# EAGLE design SchoolBoard (EAGLE 9.4.2)

## Sheet 1 of 2
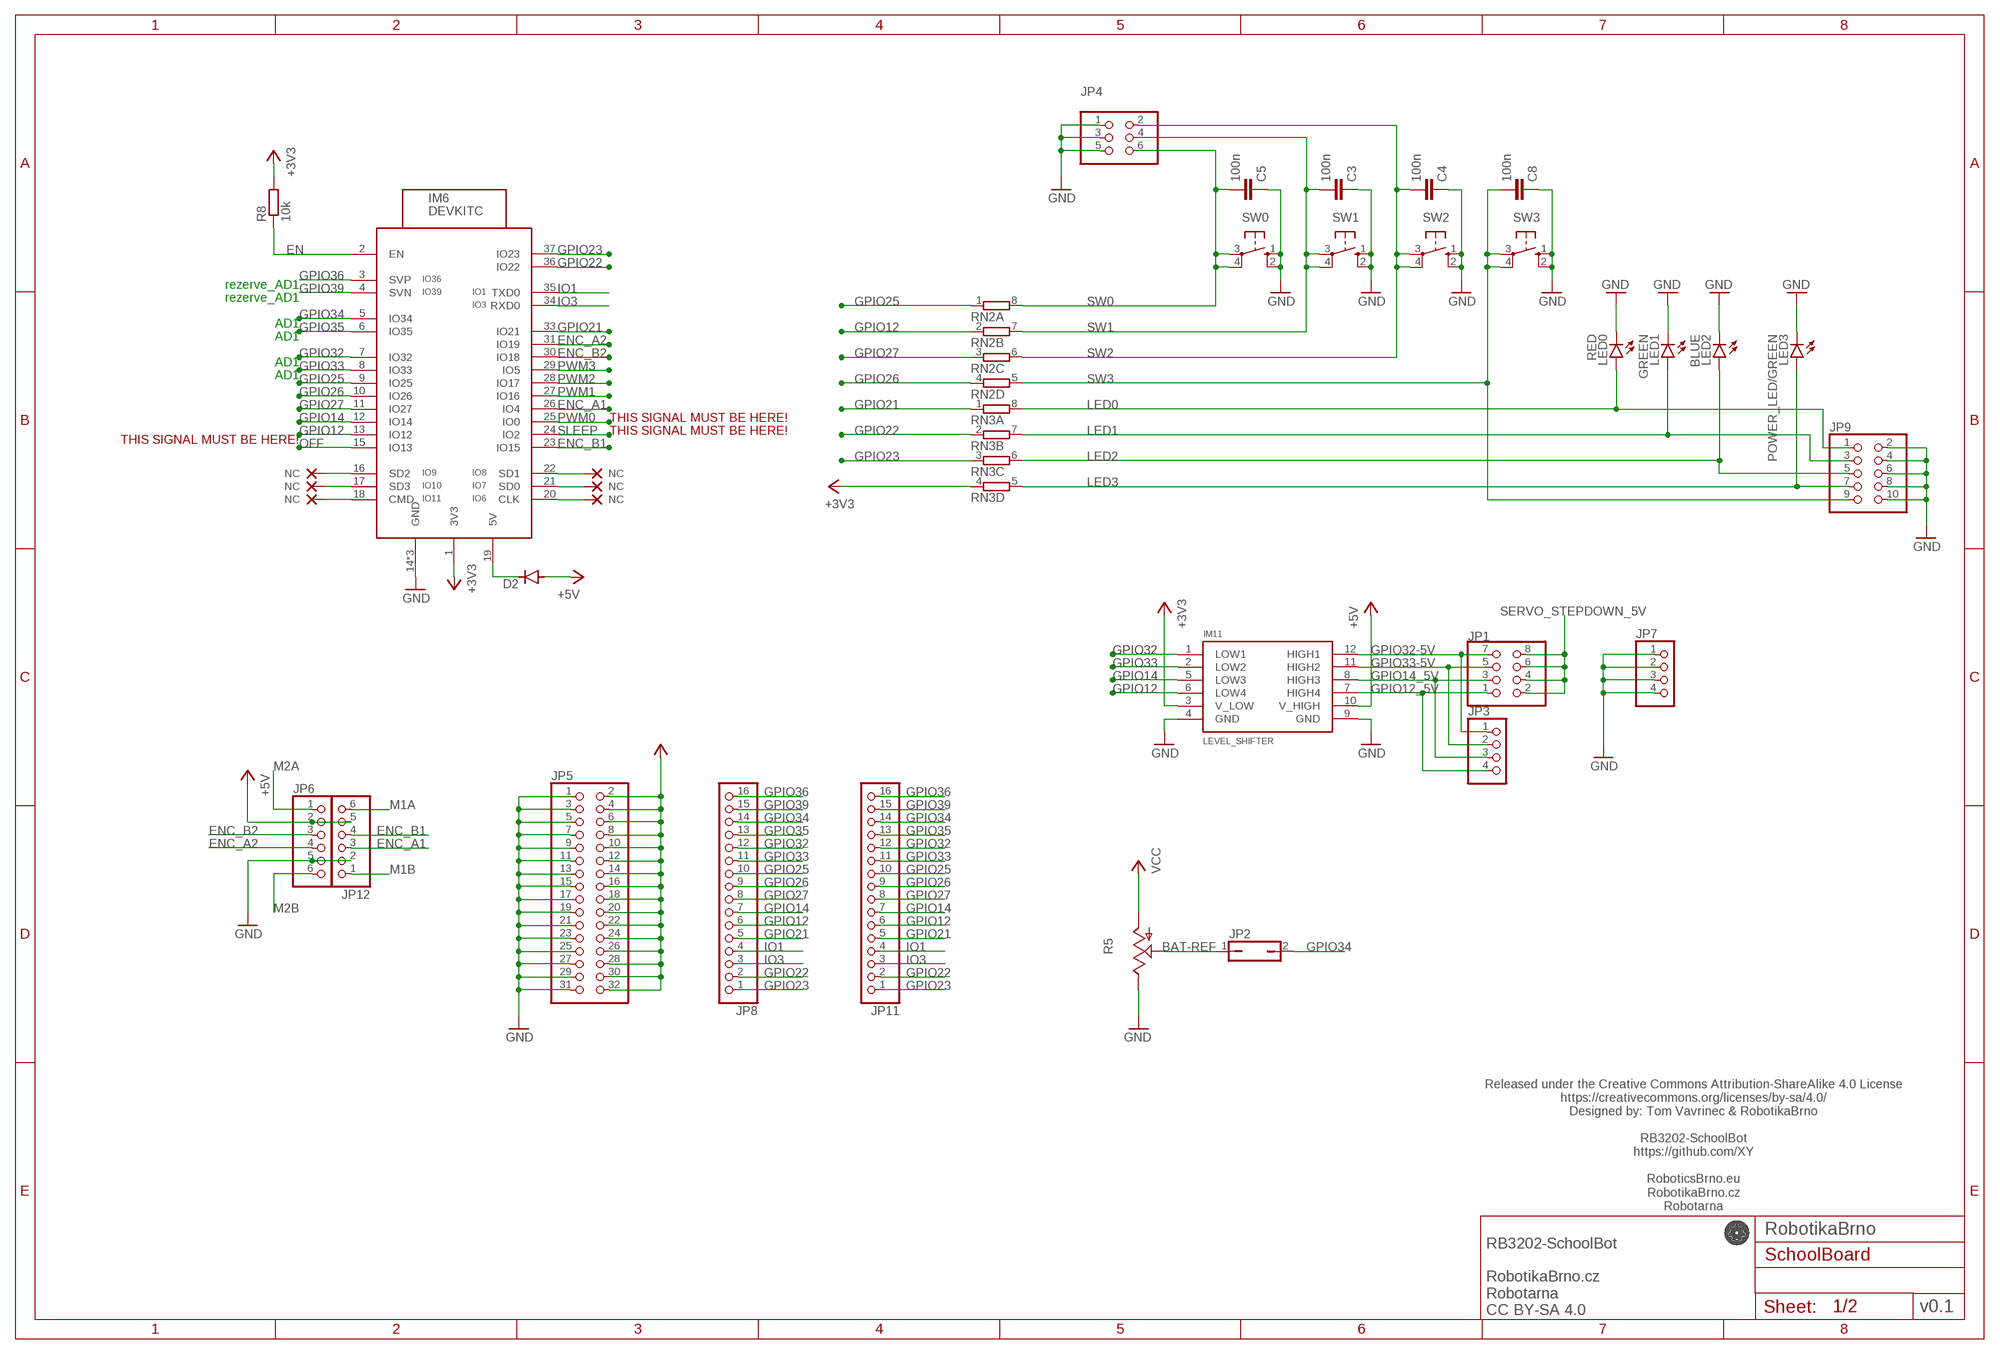
[diagram p0: schematic, sheet 1]

### Parts
C3  100n  C-EUC1206  [C1206]
C4  100n  C-EUC1206  [C1206]
C5  100n  C-EUC1206  [C1206]
C8  100n  C-EUC1206  [C1206]
D2  DIODE-D-7.5  [D-7.5]
IM6  DEVKITC  [DEVKITC]
IM11  LEVEL_SHIFTER  [LEVEL_SHIFTER]
JP1  PINHD-2X4  [2X04]
JP2  JP1Q  [JP1]
JP3  PINHD-1X4  [1X04]
JP4  PINHD-2X3  [2X03]
JP5  PINHD-2X16  [2X16]
JP6  PINHD-1X6  [1X06]
JP7  PINHD-1X4  [1X04]
JP8  PINHD-1X16  [1X16]
JP9  PINHD-2X5  [2X05]
JP11  PINHD-1X16  [1X16]
JP12  PINHD-1X6  [1X06]
LED0  RED  LED3MM  [LED3MM]
LED1  GREEN  LED3MM  [LED3MM]
LED2  BLUE  LED3MM  [LED3MM]
LED3  POWER_LED/GREEN  LED3MM  [LED3MM]
NC1  NC  (no package)
NC2  NC  (no package)
NC3  NC  (no package)
NC4  NC  (no package)
NC5  NC  (no package)
NC6  NC  (no package)
R5  TRIM_US-SM-42/43X  [SM-42/43X]
R8  10k  R-EU_R0805  [R0805]
RN2  4R-NEXBS8V  [EXBS8V]
RN3  4R-NEXBS8V  [EXBS8V]
SW0  10-XX  [B3F-10XX]
SW1  10-XX  [B3F-10XX]
SW2  10-XX  [B3F-10XX]
SW3  10-XX  [B3F-10XX]

### Nets
+3V3: IM6.1(3V3) IM11.3(V_LOW) JP5.2 JP5.4 JP5.6 JP5.8 JP5.10 JP5.12 JP5.14 JP5.16 JP5.18 JP5.20 JP5.22 JP5.24 JP5.26 JP5.28 JP5.30 JP5.32 R8.2 RN3.4 ; also sheet 2
+5V: D2.A IM11.10(V_HIGH) JP6.2 JP12.5 ; also sheet 2
+5V_ESP: D2.C IM6.19(5V)
BAT-REF: JP2.1 R5.2(S)
EN: IM6.2(EN) R8.1 ; also sheet 2
ENC_A1: IM6.26(IO4) JP12.3
ENC_A2: IM6.31(IO19) JP6.4
ENC_B1: IM6.23(IO15) JP12.4
ENC_B2: IM6.30(IO18) JP6.3
GND: C3.1 C4.1 C5.1 C8.1 IM6.14(GND) IM6.32(GND) IM6.38(GND) IM11.4(GND) IM11.9(GND) JP4.1 JP4.3 JP4.5 JP5.1 JP5.3 JP5.5 JP5.7 JP5.9 JP5.11 JP5.13 JP5.15 JP5.17 JP5.19 JP5.21 JP5.23 JP5.25 JP5.27 JP5.29 JP5.31 JP6.5 JP7.1 JP7.2 JP7.3 JP7.4 JP9.2 JP9.4 JP9.6 JP9.8 JP9.10 JP12.2 LED0.K(C) LED1.K(C) LED2.K(C) LED3.K(C) R5.3(E) SW0.1(S) SW0.2(S1) SW1.1(S) SW1.2(S1) SW2.1(S) SW2.2(S1) SW3.1(S) SW3.2(S1) ; also sheet 2
GPIO12: IM6.13(IO12) IM11.6(LOW4) JP8.6 JP11.6 RN2.2
GPIO12_5V: IM11.7(HIGH4) JP1.1 JP3.4
GPIO14: IM6.12(IO14) IM11.5(LOW3) JP8.7 JP11.7
GPIO14_5V: IM11.8(HIGH3) JP1.3 JP3.3
GPIO21: IM6.33(IO21) JP8.5 JP11.5 RN3.1
GPIO22: IM6.36(IO22) JP8.2 JP11.2 RN3.2
GPIO23: IM6.37(IO23) JP8.1 JP11.1 RN3.3
GPIO25: IM6.9(IO25) JP8.10 JP11.10 RN2.1
GPIO26: IM6.10(IO26) JP8.9 JP11.9 RN2.4
GPIO27: IM6.11(IO27) JP8.8 JP11.8 RN2.3
GPIO32: IM6.7(IO32) IM11.1(LOW1) JP8.12 JP11.12
GPIO32-5V: IM11.12(HIGH1) JP1.7 JP3.1
GPIO33: IM6.8(IO33) IM11.2(LOW2) JP8.11 JP11.11
GPIO33-5V: IM11.11(HIGH2) JP1.5 JP3.2
GPIO34: IM6.5(IO34) JP2.2 JP8.14 JP11.14
GPIO35: IM6.6(IO35) JP8.13 JP11.13 ; also sheet 2
GPIO36: IM6.3(SVP) JP8.16 JP11.16
GPIO39: IM6.4(SVN) JP8.15 JP11.15
IO1: IM6.35(TXD0) JP8.4 JP11.4
IO3: IM6.34(RXD0) JP8.3 JP11.3
IO9_NC: IM6.16(SD2) NC1.NC
IO9_NC1: IM6.20(CLK) NC4.NC
IO10_NC: IM6.17(SD3) NC2.NC
IO10_NC1: IM6.21(SD0) NC5.NC
IO11_NC: IM6.18(CMD) NC3.NC
IO11_NC1: IM6.22(SD1) NC6.NC
LED0: JP9.1 LED0.A RN3.8
LED1: JP9.3 LED1.A RN3.7
LED2: JP9.5 LED2.A RN3.6
LED3: JP9.7 LED3.A RN3.5
M1A: JP12.6 ; also sheet 2
M1B: JP12.1 ; also sheet 2
M2A: JP6.1 ; also sheet 2
M2B: JP6.6 ; also sheet 2
OFF: IM6.15(IO13) ; also sheet 2
PWM0: IM6.25(IO0) ; also sheet 2
PWM1: IM6.27(IO16) ; also sheet 2
PWM2: IM6.28(IO17) ; also sheet 2
PWM3: IM6.29(IO5) ; also sheet 2
SERVO_STEPDOWN_5V: JP1.2 JP1.4 JP1.6 JP1.8 ; also sheet 2
SLEEP: IM6.24(IO2) ; also sheet 2
SW0: C5.2 JP4.6 RN2.8 SW0.3(P) SW0.4(P1)
SW1: C3.2 JP4.4 RN2.7 SW1.3(P) SW1.4(P1)
SW2: C4.2 JP4.2 RN2.6 SW2.3(P) SW2.4(P1)
SW3: C8.2 JP9.9 RN2.5 SW3.3(P) SW3.4(P1)
VCC: R5.1(A) ; also sheet 2

### Notes on the sheet
- rezerve_AD1
- rezerve_AD1
- AD1
- AD1
- AD1
- AD1
- THIS SIGNAL MUST BE HERE!
- THIS SIGNAL MUST BE HERE! | THIS SIGNAL MUST BE HERE!
- Released under the Creative Commons Attribution-ShareAlike 4.0 License
  https://creativecommons.org/licenses/by-sa/4.0/
  Designed by: Tom Vavrinec & RobotikaBrno
  
  RB3202-SchoolBot
  https://github.com/XY
  
  RoboticsBrno.eu
  RobotikaBrno.cz
  Robotarna
- RobotikaBrno
- v0.1
- RB3202-SchoolBot
  
  RobotikaBrno.cz
  Robotarna
  CC BY-SA 4.0

## Sheet 2 of 2
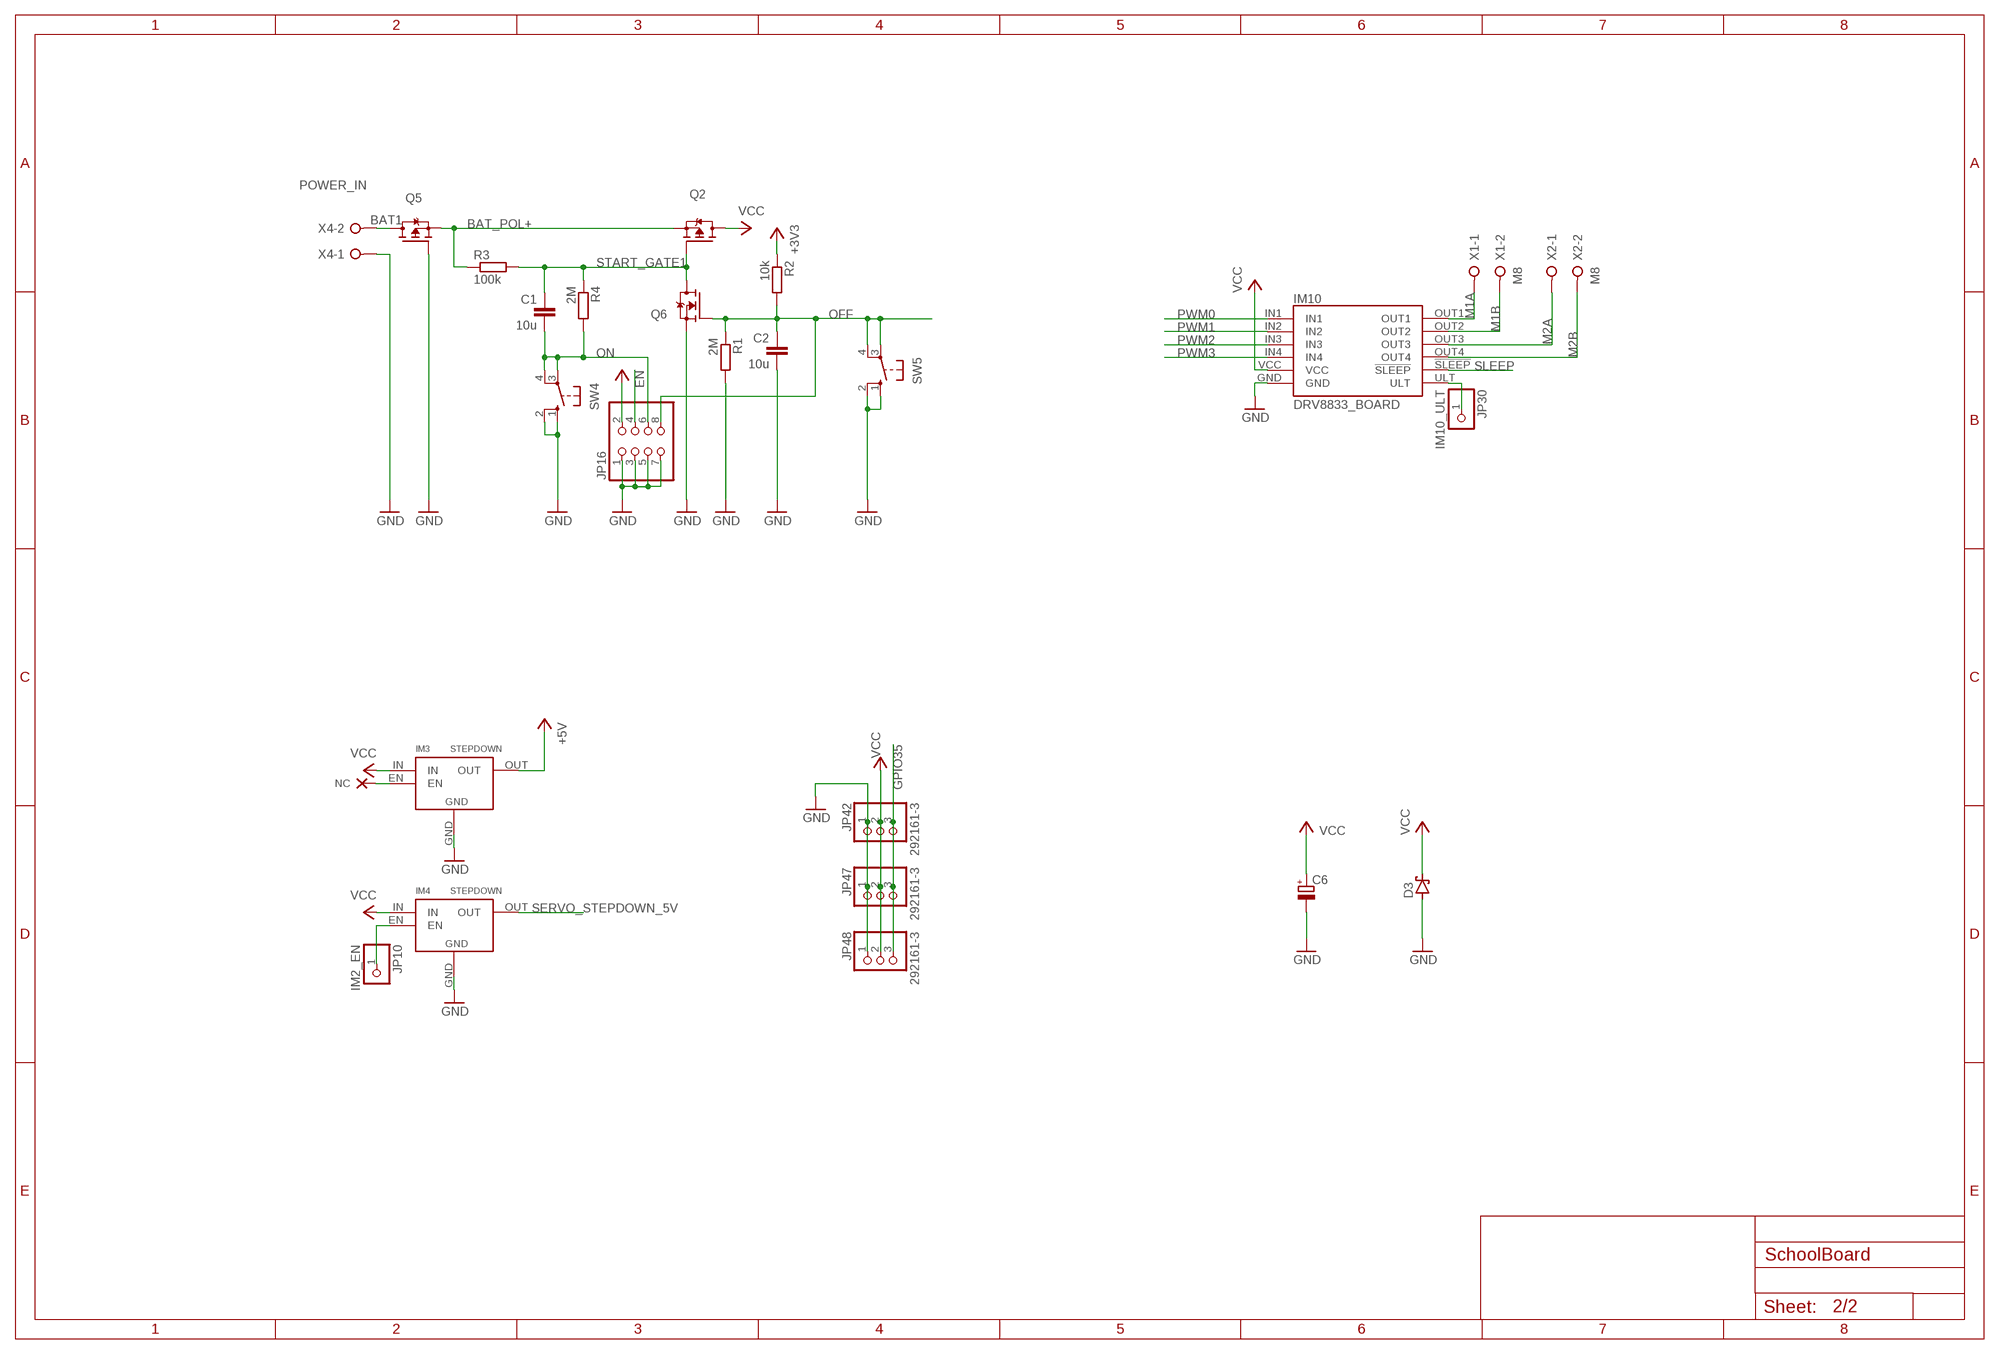
[diagram p1: schematic, sheet 2]

### Parts
C1  10u  C-EUC1206  [C1206]
C2  10u  C-EUC1206  [C1206]
C6  CPOL-EUE5-10.5  [E5-10,5]
D3  SCHOTTKY-DIODEF126Z12  [F126Z12]
IM3  STEPDOWN  [STEPDOWN]
IM4  STEPDOWN  [STEPDOWN]
IM10  DRV8833_BOARD  [PINHEAD]
JP10  IM2_EN  PINHD-1X1  [1X01]
JP16  PINHD-2X4  [2X04]
JP30  IM10_ULT  PINHD-1X1  [1X01]
JP42  292161-3  [292161-3]
JP47  292161-3  [292161-3]
JP48  292161-3  [292161-3]
NC7  NC  (no package)
Q2  P-MOSFET-TO220V  [TO220V]
Q5  P-MOSFET-TO220V  [TO220V]
Q6  N-MOSFET-SOT23-GSD  [SOT23]
R1  2M  R-EU_R0805  [R0805]
R2  10k  R-EU_R0805  [R0805]
R3  100k  R-EU_R0805  [R0805]
R4  2M  R-EU_M0805  [M0805]
SW4  10-XX  [B3F-10XX]
SW5  10-XX  [B3F-10XX]
X1  M8  W237-02P  [W237-132]
X2  M8  W237-02P  [W237-132]
X4  POWER_IN  W237-02P  [W237-132]

### Nets
+3V3: R2.1 ; also sheet 1
+5V: IM3.OUT JP16.2 ; also sheet 1
BAT1: Q5.2(D) X4.2
BAT_POL+: Q2.3(S) Q5.3(S) R3.1
EN: JP16.4 ; also sheet 1
GND: C2.2 C6.- D3.A IM3.GND IM4.GND IM10.GND JP16.1 JP16.3 JP16.5 JP16.7 JP42.1 JP47.1 JP48.1 Q5.1(G) Q6.2(S) R1.2 SW4.1(S) SW4.2(S1) SW5.1(S) SW5.2(S1) X4.1 ; also sheet 1
GPIO35: JP42.3 JP47.3 JP48.3 ; also sheet 1
IO9_NC2: IM3.EN NC7.NC
M1A: IM10.OUT1 X1.1 ; also sheet 1
M1B: IM10.OUT2 X1.2 ; also sheet 1
M2A: IM10.OUT3 X2.1 ; also sheet 1
M2B: IM10.OUT4 X2.2 ; also sheet 1
N$1: IM10.ULT JP30.1
OFF: C2.1 JP16.8 Q6.1(G) R1.1 R2.2 SW5.3(P) SW5.4(P1) ; also sheet 1
ON: C1.2 JP16.6 R4.2 SW4.3(P) SW4.4(P1)
PWM0: IM10.IN1 ; also sheet 1
PWM1: IM10.IN2 ; also sheet 1
PWM2: IM10.IN3 ; also sheet 1
PWM3: IM10.IN4 ; also sheet 1
SERVO_STEPDOWN_5V: IM4.OUT ; also sheet 1
SLEEP: IM10.!SLEEP ; also sheet 1
START_GATE1: C1.1 Q2.1(G) Q6.3(D) R3.2 R4.1
STEP2_EN1: IM4.EN JP10.1
VCC: C6.+ D3.C IM3.IN IM4.IN IM10.VCC JP42.2 JP47.2 JP48.2 Q2.2(D) ; also sheet 1

## Library data of the parts
C1-C5 C8 = rcl_upravena:C-EU: CAPACITOR, European symbol
C6 = rcl:CPOL-EU: POLARIZED CAPACITOR, European symbol; SPICEPREFIX: C
D2 = diode:DIODE-: DIODE
D3 = diode:SCHOTTKY-DIODE: Schottky Diode
IM3 IM4 = StepDown:STEPDOWN
IM6 = esp32:DEVKITC
IM10 = DRV8833board:DRV8833_BOARD
IM11 = LevelShifter:LEVEL_SHIFTER
JP1 JP16 = pinhead:PINHD-2X4: PIN HEADER
JP2 = jumper:JP1Q: JUMPER
JP3 JP7 = pinhead:PINHD-1X4: PIN HEADER
JP4 = pinhead:PINHD-2X3: PIN HEADER
JP5 = pinhead:PINHD-2X16: PIN HEADER
JP6 JP12 = pinhead:PINHD-1X6: PIN HEADER
JP8 JP11 = pinhead:PINHD-1X16: PIN HEADER
JP9 = pinhead:PINHD-2X5: PIN HEADER
JP10 JP30 = pinhead:PINHD-1X1: PIN HEADER
JP42 JP47 JP48 = iServo_connector:292161-3
LED0 LED1-LED3 = led:LED: LED OSRAM: - CHIPLED LG R971, LG N971, LY N971, LG Q971, LY Q971, LO R971, LY R971 LH N974, LH R974 LS Q976, LO Q976, LY Q976 LO Q996 - Hyper CHIPLED LW Q18S LB Q993, LB Q99A, LB R99A - SideLED LS A670, LO A670, LY A670, LG A670, LP A670 LB A673, LV A673, LT A673, LW A673 LH A674 LY A675 LS A676, LA A676, LO A676, LY A676, LW A676 LS A679, LY A679, LG A679 - Hyper Micro SIDELED® LS Y876, LA Y876, LO Y876, LY Y876 LT Y87S - SmartLED LW L88C, LW L88S LB L89C, LB L89S, LG L890 LS L89K, LO L89K, LY L89K LS L896, LA L896, LO L896, LY L896 - TOPLED LS T670, LO T670, LY T670, LG T670, LP T670 LSG T670, LSP T670, LSY T670, LOP T670, LYG T670 LG T671, LOG T671, LSG T671 LB T673, LV T673, LT T673, LW T673 LH T674 LS T676, LA T676, LO T676, LY T676, LB T676, LH T676, LSB T676, LW T676 LB T67C, LV T67C, LT T67C, LS T67K, LO T67K, LY T67K, LW E67C LS E67B, LA E67B, LO E67B, LY E67B, LB E67C, LV E67C, LT E67C LW T67C LS T679, LY T679, LG T679 LS T770, LO T770, LY T770, LG T770, LP T770 LB T773, LV T773, LT T773, LW T773 LH T774 LS E675, LA E675, LY E675, LS T675 LS T776, LA T776, LO T776, LY T776, LB T776 LHGB T686 LT T68C, LB T68C - Hyper Mini TOPLED® LB M676 - Mini TOPLED Santana® LG M470 LS M47K, LO M47K, LY M47K Source: http://www.osram.convergy.de LUXEON: - LUMILED® LXK2-PW12-R00, LXK2-PW12-S00, LXK2-PW14-U00, LXK2-PW14-V00 LXK2-PM12-R00, LXK2-PM12-S00, LXK2-PM14-U00 LXK2-PE12-Q00, LXK2-PE12-R00, LXK2-PE12-S00, LXK2-PE14-T00, LXK2-PE14-U00 LXK2-PB12-K00, LXK2-PB12-L00, LXK2-PB12-M00, LXK2-PB14-N00, LXK2-PB14-P00, LXK2-PB14-Q00 LXK2-PR12-L00, LXK2-PR12-M00, LXK2-PR14-Q00, LXK2-PR14-R00 LXK2-PD12-Q00, LXK2-PD12-R00, LXK2-PD12-S00 LXK2-PH12-R00, LXK2-PH12-S00 LXK2-PL12-P00, LXK2-PL12-Q00, LXK2-PL12-R00 Source: www.luxeon.com KINGBRIGHT: KA-3528ASYC Source: www.kingbright.com
NC1-NC7 = NC:NC: _EXTERNAL_
Q2 Q5 = transistors:P-MOSFET
Q6 = transistors:N-MOSFET
R1-R4 R8 = rcl_upravena:R-EU_: RESISTOR, European symbol
R5 = pot:TRIM_US-: POTENTIOMETER
RN2 RN3 = resistor-dil:4R-N: Array Chip Resistor Source: RS Component / Phycomp; OC_FARNELL: unknown; OC_NEWARK: unknown
SW0 SW1-SW5 = switch-omron:10-XX: OMRON SWITCH; MPN: B3F-1000; OC_FARNELL: 176432; OC_NEWARK: 36M3542
X1 X2 X4 = con-wago-508:W237-02P: WAGO SREW CLAMP; OC_FARNELL: unknown; OC_NEWARK: unknown

## Net classes
0 default: width 0.2 mm, drill 0.35 mm, clearance 0.2 mm

## Board
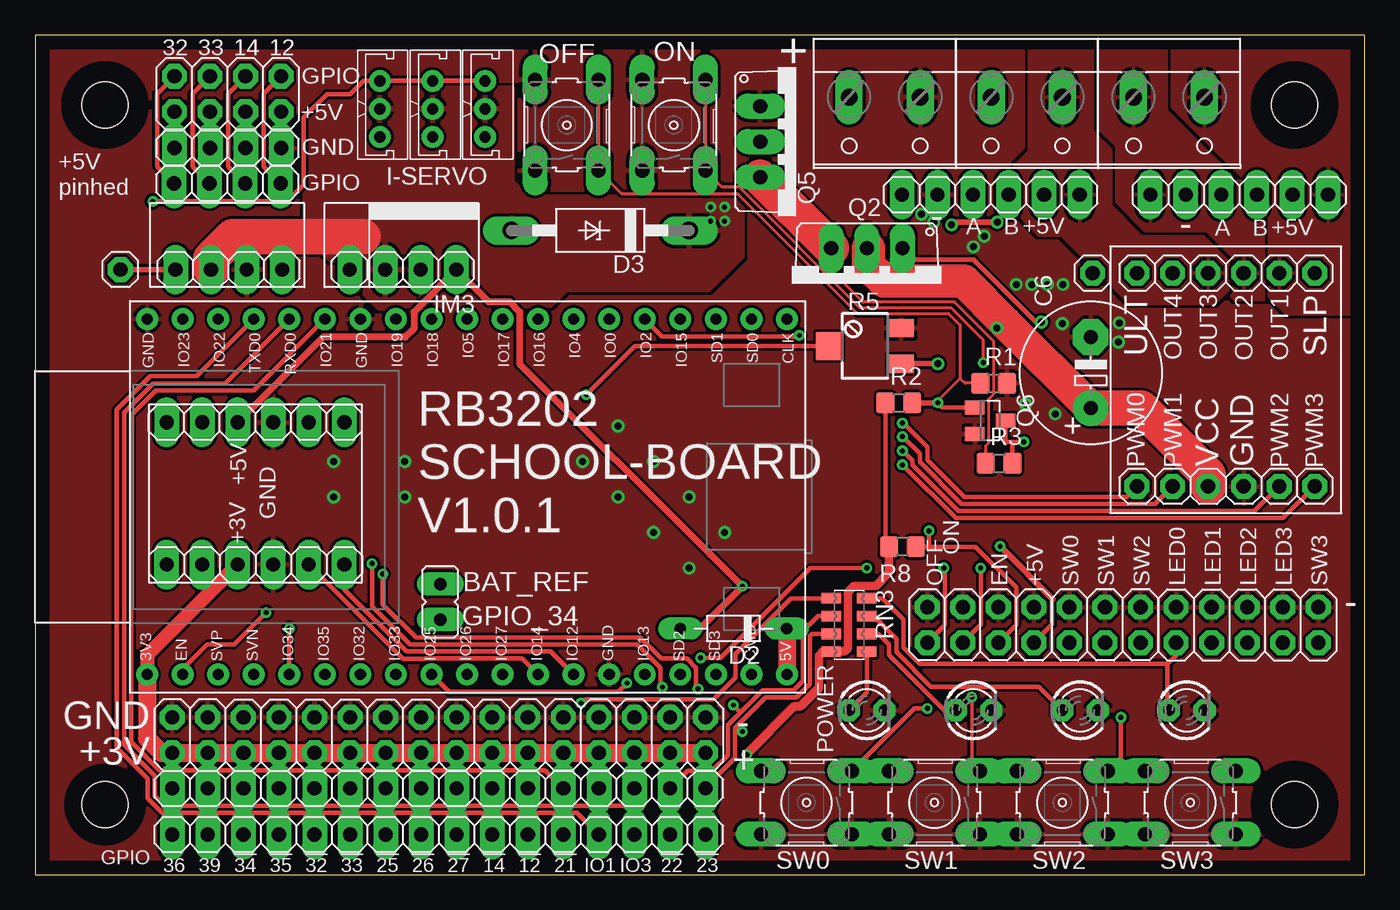
[diagram p2: board, top side]
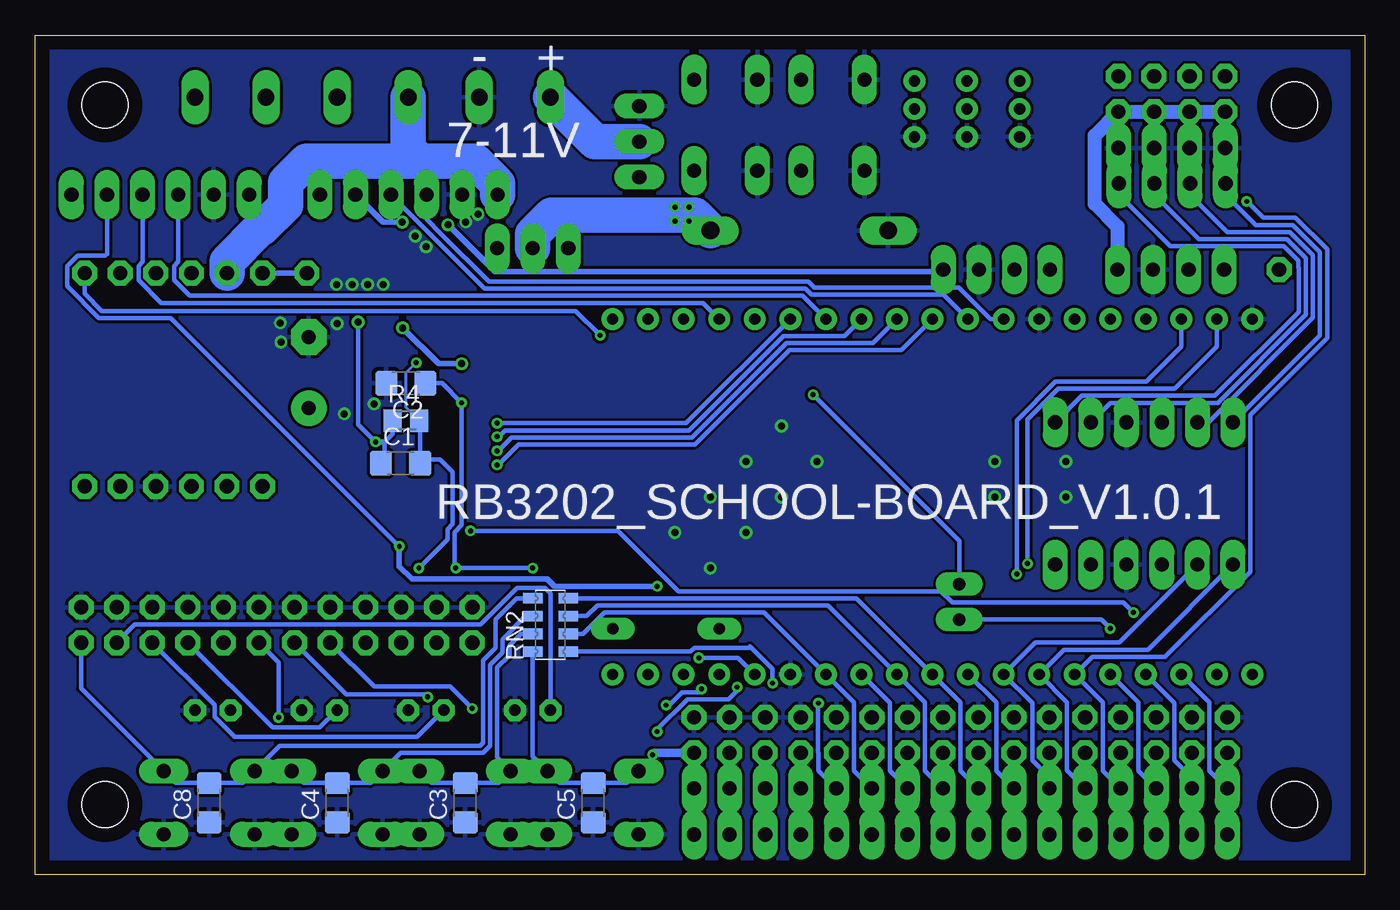
[diagram p3: board, bottom side, seen from below]

Size 95 x 60 mm. Coordinates in mm from the lower left corner, seen from the top.
Outline: 95,60 0,60 0,0 95,0 95,60
Copper layers (1*16): Top 0.035mm / dielectric 1.5mm / Bottom 0.035mm
Design rules "gatema_2layers *": minimum track width 6mil, minimum drill 0.35mm, track to track 6mil, track to pad 6mil, pad to pad 6mil, via to via 6mil, smd to smd 6mil, copper to edge 40mil, drill to drill 6mil, minimum pad ring 15mil, minimum via ring 8mil, stop-mask expansion 4mil, vias tented up to drill 0mil, thermal gap 10mil
Holes 3.3 mm at 5,55 90,55 90,5 5,5
tRestrict: area 2.4,52.4 to 7.6,57.6; area 87.4,52.4 to 92.6,57.6; area 87.4,2.4 to 92.6,7.6; area 2.6,2.6 to 7.4,7.4

### Footprints (pad centres in the part's own frame; a part is rotated, then mirrored left to right if it is on the bottom)
C1206 = smd 1.6 x 1.8: 1 -1.4,0; 2 1.4,0
E5-10,5 = drill 1.016 pad 2.54: + -2.54,0 | drill 1.016 pad 2.54 octagon: - 2.54,0
D-7.5 = drill 0.813 long: A 3.81,0; C -3.81,0
F126Z12 = drill 1.27 long: A 6.35,0; C -6.35,0
STEPDOWN = drill 1.016 long: EN 1.27,8.89; GND 1.27,3.81; IN 1.27,6.35; OUT 1.27,1.27
DEVKITC = drill 0.8: 1 -12.7,46.99; 2 -12.7,44.45; 3 -12.7,41.91; 4 -12.7,39.37; 5 -12.7,36.83; 6 -12.7,34.29; 7 -12.7,31.75; 8 -12.7,29.21; 9 -12.7,26.67; 10 -12.7,24.13; 11 -12.7,21.59; 12 -12.7,19.05; 13 -12.7,16.51; 14 -12.7,13.97; 15 -12.7,11.43; 16 -12.7,8.89; 17 -12.7,6.35; 18 -12.7,3.81; 19 -12.7,1.27; 20 12.7,1.27; 21 12.7,3.81; 22 12.7,6.35; 23 12.7,8.89; 24 12.7,11.43; 25 12.7,13.97; 26 12.7,16.51; 27 12.7,19.05; 28 12.7,21.59; 29 12.7,24.13; 30 12.7,26.67; 31 12.7,29.21; 32 12.7,31.75; 33 12.7,34.29; 34 12.7,36.83; 35 12.7,39.37; 36 12.7,41.91; 37 12.7,44.45; 38 12.7,46.99
PINHEAD = drill 1.016 octagon: !SLEEP 1.27,13.97; GND 16.51,8.89; IN1 16.51,1.27; IN2 16.51,3.81; IN3 16.51,11.43; IN4 16.51,13.97; OUT1 1.27,11.43; OUT2 1.27,8.89; OUT3 1.27,6.35; OUT4 1.27,3.81; ULT 1.27,1.27; VCC 16.51,6.35
LEVEL_SHIFTER = drill 1.016 long: 1 1.27,1.27; 2 3.81,1.27; 3 6.35,1.27; 4 8.89,1.27; 5 11.43,1.27; 6 13.97,1.27; 7 13.97,11.43; 8 11.43,11.43; 9 8.89,11.43; 10 6.35,11.43; 11 3.81,11.43; 12 1.27,11.43
2X04 = drill 1.016 octagon: 1 -3.81,-1.27; 2 -3.81,1.27; 3 -1.27,-1.27; 4 -1.27,1.27; 5 1.27,-1.27; 6 1.27,1.27; 7 3.81,-1.27; 8 3.81,1.27
JP1 = drill 0.914 long: 1 0,-1.27; 2 0,1.27
1X04 = drill 1.016 long: 1 -3.81,0; 2 -1.27,0; 3 1.27,0; 4 3.81,0
2X03 = drill 1.016 octagon: 1 -2.54,-1.27; 2 -2.54,1.27; 3 0,-1.27; 4 0,1.27; 5 2.54,-1.27; 6 2.54,1.27
2X16 = drill 1.016 octagon: 1 -19.05,-1.27; 2 -19.05,1.27; 3 -16.51,-1.27; 4 -16.51,1.27; 5 -13.97,-1.27; 6 -13.97,1.27; 7 -11.43,-1.27; 8 -11.43,1.27; 9 -8.89,-1.27; 10 -8.89,1.27; 11 -6.35,-1.27; 12 -6.35,1.27; 13 -3.81,-1.27; 14 -3.81,1.27; 15 -1.27,-1.27; 16 -1.27,1.27; 17 1.27,-1.27; 18 1.27,1.27; 19 3.81,-1.27; 20 3.81,1.27; 21 6.35,-1.27; 22 6.35,1.27; 23 8.89,-1.27; 24 8.89,1.27; 25 11.43,-1.27; 26 11.43,1.27; 27 13.97,-1.27; 28 13.97,1.27; 29 16.51,-1.27; 30 16.51,1.27; 31 19.05,-1.27; 32 19.05,1.27
1X06 = drill 1.016 long: 1 -6.35,0; 2 -3.81,0; 3 -1.27,0; 4 1.27,0; 5 3.81,0; 6 6.35,0
1X16 = drill 1.016 long: 1 -19.05,0; 2 -16.51,0; 3 -13.97,0; 4 -11.43,0; 5 -8.89,0; 6 -6.35,0; 7 -3.81,0; 8 -1.27,0; 9 1.27,0; 10 3.81,0; 11 6.35,0; 12 8.89,0; 13 11.43,0; 14 13.97,0; 15 16.51,0; 16 19.05,0
2X05 = drill 1.016 octagon: 1 -5.08,-1.27; 2 -5.08,1.27; 3 -2.54,-1.27; 4 -2.54,1.27; 5 0,-1.27; 6 0,1.27; 7 2.54,-1.27; 8 2.54,1.27; 9 5.08,-1.27; 10 5.08,1.27
1X01 = drill 1.016 octagon: 1 0,0
292161-3 = drill 0.8: 1 -2,0; 2 0,0; 3 2,0
LED3MM = drill 0.813 octagon: A -1.27,0; K 1.27,0
TO220V = drill 1.016 long: 1 -2.54,-2.54; 2 0,-2.54; 3 2.54,-2.54
SOT23 = smd 1 x 1.4: 1 -0.95,-1.1; 2 0.95,-1.1; 3 0,1.1
R0805 = smd 1.3 x 1.5: 1 -0.95,0; 2 0.95,0
M0805 = smd 1.3 x 1.6: 1 -0.95,0; 2 0.95,0
SM-42/43X = smd 1.3 x 1.9: 1 -1.27,-2.55; 3 1.27,-2.55 | smd 2 x 1.9: 2 0,2.55
EXBS8V = smd 0.762 x 1.397: 1 -1.905,-1.27; 2 -0.635,-1.27; 3 0.635,-1.27; 4 1.905,-1.27; 5 1.905,1.27; 6 0.635,1.27; 7 -0.635,1.27; 8 -1.905,1.27
B3F-10XX = drill 1.016 long: 1 -3.251,2.261; 2 3.251,2.261; 3 -3.251,-2.261; 4 3.251,-2.261
W237-132 = drill 1.194 long: 1 -2.54,-0.635; 2 2.54,-0.635

### Placement (x,y rotation side)
C1  68.88,29.39 0 bottom
C2  68.5,35.11 180 bottom
C3  64.27,5.14 90 bottom
C4  73.41,5.14 90 bottom
C5  55.12,5.14 90 bottom
C6  75.44,35.87 90 top
C8  82.55,5.14 90 bottom
D2  49.91,17.58 180 top
D3  40.39,46.03 180 top
IM3  31.37,41.97 90 top
IM4  18.93,41.97 90 top
IM6  55,27 90 top
IM10  77.47,44.25 270 top
IM11  8.13,20.88 0 top
JP1  13.77,55.78 180 top
JP2  28.96,19.49 180 top
JP3  13.74,49.39 0 top
JP4  76.46,17.84 180 top
JP5  28.86,9.96 180 top
JP6  68.3,48.59 180 top
JP7  13.77,51.92 180 top
JP8  28.86,6.15 180 top
JP9  86.62,17.84 0 top
JP10  6.1,43.24 180 top
JP11  28.86,2.85 180 top
JP12  86.05,48.59 0 top
JP16  67.57,17.84 180 top
JP30  75.57,42.98 180 top
JP42  28.4,54.72 90 top
JP47  24.64,54.72 90 top
JP48  32.16,54.72 90 top
LED0  82.3,11.74 0 top
LED1  74.68,11.74 0 top
LED2  67.06,11.74 0 top
LED3  59.44,11.74 0 top
Q2  59.44,42.22 180 top
Q5  54.36,52.38 270 top
Q6  68.25,32.44 270 top
R1  68.5,35.11 0 top
R2  61.73,33.71 0 top
R3  68.88,29.39 0 top
R4  68.5,32.44 0 bottom
R5  59.31,37.77 90 top
R8  61.98,23.42 180 top
RN2  58.17,17.84 90 bottom
RN3  58.17,17.84 270 top
SW0  55.12,5.14 180 top
SW1  64.27,5.14 180 top
SW2  73.41,5.14 180 top
SW3  82.55,5.14 180 top
SW4  45.65,53.56 90 top
SW5  38,53.56 90 top
X1  81.03,54.92 180 top
X2  70.87,54.92 180 top
X4  60.71,54.92 180 top

### Tracks (layer width: path | path; a pad name or v marks a point on that pad's centre or on a via)
+3V3  (via drill 0.35)
  Top 0.305: R2.1 60.78,23.68 R8.2
  Top 0.61: R8.2 61.03,21.59 60.07,20.63 58.53,20.63 58.1,20.2 58.1,17.15 58.11,17.15 58.11,16.2 57.84,15.93 RN3.4 56.28,15.93 56.03,15.68 56.03,13.35 54.68,12 54.24,12 50.87,8.64 v50.87,8.57
  Top 1.016: IM11.3 8.01,15.68 IM6.1
  Top 1.27: IM6.1 8.01,9.73 9.05,8.69 JP5.32 JP5.30 JP5.28 JP5.26 JP5.24 JP5.22 JP5.20 JP5.18 JP5.16 JP5.14 JP5.12 JP5.10 JP5.8 JP5.6 JP5.4 JP5.2
  Bottom 0.61: v50.87,8.57 50.74,8.69 JP5.2
+5V  (via drill 0.35, 0.5)
  Top 0.305: JP16.2 72.68,17.86 72.68,19.62 72.73,19.67
  Top 0.406: 72.73,19.67 68.97,23.43 v68.97,23.46 | v68.76,46.62 65.68,46.62 v65.49,46.43
  Top 0.5: D2.A 47.53,17.58 v50.55,20.6 48.28,22.87 48.26,22.87 34.64,36.49 34.64,40.21 33.92,40.93 32.41,40.93 IM3.OUT 27.08,40.21 27.08,39.03 26.46,38.41 20.58,38.41 IM11.10
  Bottom 0.305: JP12.5 89.86,44.35 89.98,44.22 91.96,44.22 92.69,43.5 92.69,42.04 90.43,39.78 85.29,39.78 v68.97,23.46
  Bottom 0.406: v50.55,20.6 57.89,20.6 58.41,21.12 68.05,21.12 68.97,22.03 v68.97,23.46 | JP6.2 70.14,46.62 v68.76,46.62 | v65.49,46.43 62.14,43.08 30.26,43.08 IM3.OUT
+5V_ESP
  Top 1.27: D2.C IM6.19
BAT1
  Bottom 2.54: Q5.2 54.99,52.38 X4.2
BAT-REF  (via drill 0.35)
  Top 0.305: R5.2 42.88,37.78 v39.4,34.29
  Bottom 0.305: v39.4,34.29 28.96,23.85 JP2.1
BAT_POL+
  Top 0.2: R3.1 67.93,30.65 68.15,30.87 68.15,33.99 68.5,34.35 68.5,38.09
  Top 0.203: 68.5,38.09 65.69,40.9 59.16,40.9 56.9,43.16 Q2.3
  Top 2.54: Q5.3 Q2.3
EN  (via drill 0.35)
  Top 0.305: JP16.4 70.11,17.84 70.11,20.5 67.19,23.42 63.88,23.42 | v16.51,18.73 14.23,16.44 12.31,16.44 10.55,14.68 IM6.2 | 63.88,23.42 v63.88,24.57 | 63.88,23.42 R8.1
  Bottom 0.305: v63.88,24.57 53.34,24.57 49.02,20.25 30.26,20.25 29.45,19.44 17.23,19.44 v16.51,18.73
ENC_A1
  Bottom 0.305: JP12.3 84.78,43.79 85.07,43.5 85.07,42.47 83.96,41.36 40.15,41.36 IM6.26
ENC_A2
  Bottom 0.305: IM6.31 26.73,39.7 28.98,41.95 39.31,41.95 39.73,42.37 62.57,42.37 65.98,45.78 67.03,46.83 JP6.4
ENC_B1
  Bottom 0.305: JP12.4 87.32,43.79 87.61,43.5 87.61,42.47 85.99,40.86 47.27,40.86 IM6.23
ENC_B2
  Bottom 0.305: IM6.30 30.07,41.44 39.52,41.44 39.94,41.86 62.86,41.86 69.57,48.57 JP6.3
GND  (via drill 0.5)
  other vias: 46.74,26.98 44.2,29.52 41.66,32.06 39.12,29.52 41.66,26.98 44.2,24.44 46.74,21.9 49.28,24.44 26.42,26.98 26.42,29.52 21.34,29.52 21.34,26.98 70.77,33.63 72.9,32.92 67.82,45.62 67.06,44.86 64.22,46.64 63.35,47.2 73.46,42.17 72.34,42.17 71.23,42.17 70.11,42.17 73.41,39.38 77.47,39.43 77.42,38.05
  pour Top (rank 6): -2.54,60.97 -2.54,-2.53 99.06,-2.53 99.06,63.51 -2.54,63.51
  pour Bottom (rank 6): -5.08,66.05 -5.08,-5.07 101.6,-5.07 101.6,66.05
GPIO12
  Top 0.305: IM6.13 36.85,15.94 26.54,15.94 22.1,20.38 IM11.6
  Bottom 0.305: JP11.6 JP8.6 36.48,7.42 36.48,12.29 IM6.13 42.91,18.73 54.31,18.73 55.83,17.2 RN2.2
GPIO12_5V
  Top 0.305: JP1.1 16.34,55.81 16.34,50.6 JP3.4
  Bottom 0.305: IM11.7 20.2,34.22 10.7,34.22 4.7,40.21 4.7,43.36 4.73,43.39 4.73,43.88 5.77,44.91 13.87,44.91 17.55,48.59 JP3.4
GPIO14
  Top 0.305: IM11.5 26.29,15.42 27.85,15.42 27.86,15.43 34.82,15.43 IM6.12
  Bottom 0.305: JP11.7 JP8.7 33.91,7.39 33.91,12.26 IM6.12
GPIO14_5V
  Top 0.305: JP1.3 13.8,55.81 13.8,50.6 JP3.3
  Bottom 0.305: IM11.8 18.16,33.71 10.49,33.71 4.2,40 4.2,44.06 5.56,45.42 11.84,45.42 15.01,48.59 JP3.3
GPIO21  (via drill 0.35)
  Top 0.305: RN3.1 54.02,19.74 50.06,15.78 50.06,14.1 48.48,12.53 39.3,12.53 v39.02,12.25 | JP8.5 36.45,7.45 8.89,7.45 6.88,9.47 6.88,14.77 6.86,14.79 6.86,32.82 8.64,34.6 15.62,34.6 IM6.33
  Bottom 0.305: JP11.5 JP8.5 39.02,7.42 39.02,8.69 39.05,8.72 39.05,12.22 v39.02,12.25
GPIO22  (via drill 0.35)
  Top 0.305: RN3.2 55.93,18.47 54.87,17.4 54.87,13.84 54.2,13.17 51.98,13.17 50.41,11.6 | JP11.2 JP8.2 46.64,7.42 47.02,7.42 47.05,7.45 48.42,7.45 49.5,8.53 49.5,10.7 50.41,11.6 | v47.38,13.26 47.24,13.4 47.24,14.77 46.58,15.43 44.75,15.43 43.24,16.95 27.22,16.95 24.85,19.31 v24.85,21.47 | v49.9,12.1 50.41,11.6
  Bottom 0.305: IM6.36 13.09,37.72 15.58,35.23 22.08,35.23 24.85,32.46 v24.85,21.47 | v49.9,12.1 49.68,12.1 48.75,13.03 47.61,13.03 v47.38,13.26
GPIO23  (via drill 0.35)
  Top 0.305: 50.01,10.49 50.01,8.32 47.91,6.22 JP8.1 JP11.1 | 50.01,10.49 52.19,12.66 54.41,12.66 55.37,13.63 55.37,17.07 55.5,17.2 RN3.3 | v44.84,13.39 44.7,13.52 44.7,14.77 43.03,16.44 26.81,16.44 24.08,19.18 v24.08,22.23 | 50.01,10.49 50.28,10.49 v50.55,10.22
  Bottom 0.305: IM6.37 10.55,37.72 13.54,34.72 21.87,34.72 24.08,32.51 v24.08,22.23 | v50.55,10.22 50.55,10.37 48.39,12.53 45.45,12.53 44.84,13.14 v44.84,13.39
GPIO25  (via drill 0.35)
  Top 0.305: v42.29,13.68 41.66,13.04 29.59,13.04 IM6.9
  Bottom 0.305: IM6.9 26.32,12.29 26.32,7.42 JP8.10 JP11.10 | 43.91,16.31 43.82,16.21 | v42.29,13.68 42.29,14.69 43.02,15.41 43.82,16.21 | RN2.1 48.15,15.93 47.86,16.21 43.82,16.21
GPIO26
  Bottom 0.305: JP11.9 JP8.9 28.86,7.42 28.86,12.29 IM6.10 36.31,19.74 RN2.4
GPIO27
  Bottom 0.305: JP11.8 JP8.8 31.4,7.42 31.4,12.29 IM6.11 38.34,19.23 54.81,19.23 55.58,18.47 RN2.3
GPIO32
  Bottom 0.305: JP11.12 JP8.12 21.27,7.45 21.27,12.32 IM6.7 21.48,16.07 15.49,16.07 IM11.1
GPIO32-5V
  Top 0.305: JP3.1 8.72,50.6 8.72,55.81 JP1.7
  Bottom 0.305: IM11.12 3.18,38.53 3.18,44.47 5.14,46.43 7.77,46.43 9.93,48.59 JP3.1
GPIO33
  Bottom 0.305: JP11.11 JP8.11 22.51,6.94 23.75,8.18 23.75,12.26 IM6.8 23.52,16.57 17.52,16.57 IM11.2
GPIO33-5V
  Top 0.305: JP1.5 11.26,55.81 11.26,50.6 JP3.2
  Bottom 0.305: IM11.11 11.17,32.31 3.69,39.8 3.69,41.83 3.69,41.84 3.69,41.85 3.69,44.27 5.35,45.92 9.8,45.92 12.47,48.59 JP3.2
GPIO34  (via drill 0.35)
  Top 0.305: v18.17,17.58 IM6.5
  Bottom 0.305: IM6.5 16.16,12.29 16.16,7.42 JP8.14 JP11.14 | JP2.2 18.8,18.22 v18.17,17.58
GPIO35  (via drill 0.35)
  Top 0.305: JP48.3 JP42.3 JP47.3 23.47,56.72 22.53,55.78 20.86,55.78 19.21,54.14 19.21,49.3 18.02,48.11 v8.41,48.11
  Bottom 0.305: JP11.13 JP8.13 18.7,7.42 18.7,12.29 IM6.6 19.46,15.55 14.25,15.55 8.16,21.64 8.16,32.84 2.68,38.32 2.68,44.68 4.93,46.93 7.24,46.93 v8.41,48.11
GPIO36
  Bottom 0.305: IM6.3 11.08,12.29 11.08,7.42 JP8.16 JP11.16
GPIO39
  Bottom 0.305: JP11.15 JP8.15 12.35,6.94 13.59,8.18 13.59,12.26 IM6.4
IO1
  Top 0.305: JP11.4 38.73,4.41 9.08,4.41 8.06,5.43 8.06,6.85 5.85,9.06 5.85,33.24 8.22,35.61 11.54,35.61 IM6.35
  Bottom 0.305: JP8.4 JP11.4
IO3
  Top 0.305: JP8.3 42.83,5.01 | 42.83,5.01 JP11.3 | IM6.34 13.57,35.11 8.43,35.11 6.36,33.03 6.36,9.27 8.57,7.06 8.57,5.64 9.29,4.91 42.73,4.91 42.83,5.01
LED0
  Top 0.305: RN3.8 60.54,19.74 62.04,18.23 62.04,16.24 63.22,15.07 80.91,15.07 80.91,15.04 | JP9.1 81.54,15.67 80.91,15.04 | 80.91,15.04 80.91,11.86 LED0.A
LED1
  Top 0.305: RN3.7 59.9,18.47 61.54,16.83 61.54,15.9 64.01,13.42 71.73,13.42 LED1.A
  Bottom 0.305: JP9.3 78.01,10.5 74.65,10.5 LED1.A
LED2
  Top 0.305: 59.52,17.2 RN3.6 60.28,17.2 61.03,16.44 61.03,15.69 64.98,11.74 LED2.A
  Bottom 0.305: LED2.A 67.69,9.84 80.74,9.84 82.17,11.27 82.17,12.12 JP9.5
LED3
  Top 0.305: RN3.5 59.44,13.01 LED3.A
  Bottom 0.305: LED3.A 58.17,20.09 58.55,20.47 60.56,20.47 63.17,17.86 87.86,17.86 JP9.7
M1A
  pour Top: 97.5,40.02 89.44,40.02 88.2,41.26 88.2,47.9 81.28,54.82 81.28,60.97 97.5,60.97
M1B
  pour Top (rank 2): 88.28,41.17 88.28,48.18 81.55,54.92 81.55,60.97 75.3,60.97 75.3,53.19 76.6,51.89 76.6,47.73 78.93,45.41 83.38,45.41 84.75,44.04 84.75,42.03 85.68,41.1 88.21,41.1
M2A
  pour Top: 85.26,41.76 85.26,43.84 83.5,45.6 79.1,45.6 76.9,47.8 76.9,51.8 75.6,53.1 75.6,60.97 71,60.97 71,51.7 69.5,50.2 69.5,47.9 71.7,45.7 73.3,45.7 78.2,40.8 84.3,40.8
M2B
  Bottom 2.54: IM10.OUT4 81.28,43.82 78.87,46.23 78.72,46.23 77.1,47.85 77.1,49.5 75.6,51 67.5,51 | 67.5,51 63.56,51 61.95,49.39 JP6.6 | X2.2 68.33,51.83 67.5,51
N$1
  Bottom 0.406: IM10.ULT JP30.1
OFF  (via drill 0.35)
  Top 0.2: 66.11,39.27 66.11,35.45 | SW5.4 SW5.3 | 66.11,35.45 66.45,35.11 R1.1 | v64.52,33.71 64.52,33.86 66.11,35.45
  Top 0.203: SW5.3 41.91,48.66 50.21,48.66 58.77,40.09 65.28,40.09 66.11,39.27
  Top 0.305: v64.52,33.71 64.84,33.39 Q6.1 | JP16.8 65.03,17.84 65.03,21.82 v64.93,21.91 | v47.56,15.48 48.99,15.48 55.41,21.9 v59.44,21.9
  Top 0.406: v64.52,33.71 R2.2
  Bottom 0.305: IM6.15 44.75,15.48 v47.56,15.48 | C2.1 65.92,35.11 v64.52,33.71 64.52,24.97 65.03,24.46 65.03,22.01 v64.93,21.91 64.92,21.9 v59.44,21.9
ON  (via drill 0.35)
  Top 0.2: v67.76,36.59 67.76,38.21 | SW4.4 SW4.3
  Top 0.203: 67.76,38.21 65.47,40.5 58.94,40.5 50.29,49.15 49.06,49.15 SW4.3
  Top 0.305: JP16.6 67.6,17.86 67.6,21.87 v67.57,21.9
  Bottom 0.2: R4.2 68.5,33.39 68.5,35.87 67.78,36.59 v67.76,36.59
  Bottom 0.305: R4.2 67.48,32.37 C1.2 67.23,29.65 66.04,29.65 65.16,28.76 65.16,25.04 65.53,24.67 65.53,23.94 v67.57,21.9
PWM0  (via drill 0.35)
  Top 0.305: IM10.IN1 78.74,27.7 78.02,26.98 66.42,26.98 63.76,29.64 63.76,30.55 62.06,32.25 v61.98,32.25
  Bottom 0.305: IM6.25 48.48,32.25 v61.98,32.25
PWM1  (via drill 0.35)
  Top 0.305: IM10.IN2 80.02,26.48 66.21,26.48 63.21,29.47 63.21,30.08 62,31.3 v61.98,31.3
  Bottom 0.305: IM6.27 37.15,38.5 41.52,38.5 48.27,31.75 61.41,31.75 61.86,31.3 v61.98,31.3
PWM2  (via drill 0.35)
  Top 0.305: IM10.IN3 87.13,25.97 66,25.97 62.71,29.26 62.71,29.58 62,30.28 v61.98,30.28
  Bottom 0.305: v61.98,30.28 61.92,30.28 60.96,31.25 48.06,31.25 41.31,38 35.11,38 IM6.28
PWM3  (via drill 0.35)
  Top 0.305: IM10.IN4 89.17,25.47 65.79,25.47 v61.98,29.27
  Bottom 0.305: IM6.29 33.08,37.49 41.1,37.49 47.85,30.74 60.46,30.74 61.93,29.27 v61.98,29.27
SERVO_STEPDOWN_5V
  Bottom 1.016: IM4.OUT 17.66,46.31 19.28,47.93 19.28,52.82 JP1.2 JP1.4 JP1.6 JP1.8
SLEEP  (via drill 0.35)
  Top 0.305: IM6.24 44.81,38.46 54.54,38.46 v54.61,38.54
  Bottom 0.305: v54.61,38.54 56.36,40.29 90.22,40.29 91.44,41.51 IM10.!SLEEP
START_GATE1  (via drill 0.35, 0.5)
  Top 0.305: 69.83,30.92 R3.2 | 69.83,30.92 69.45,30.92 69.35,31.02 Q6.3 | v70.66,30.92 69.83,30.92 | Q2.1 62.79,43.95 67.06,43.95 | 67.06,43.95 67.11,43.95 | 67.06,43.95 71.54,39.48 v71.91,39.48
  Bottom 0.305: C1.1 70.02,29.65 70.02,30.92 69.45,31.49 R4.1 | v71.91,39.48 71.91,32.17 v70.66,30.92
  Bottom 0.406: 70.02,30.92 v70.66,30.92
STEP2_EN1
  Top 0.406: IM4.EN JP10.1
SW0  (via drill 0.35)
  Top 0.305: v63.76,11.87 62.84,11.87 SW0.3
  Bottom 0.305: RN2.8 59.44,8.46 SW0.3 57.51,6.54 C5.2 52.73,6.54 SW0.4 | JP4.6 73.9,16.57 70.77,13.44 65.33,13.44 v63.76,11.87
SW1  (via drill 0.35)
  Top 0.254: 66.93,7.98 v66.93,12.69
  Top 0.305: 66.93,7.98 SW1.3
  Bottom 0.305: 59.57,17.2 RN2.7 60.28,17.2 61.09,16.39 61.09,15.67 61.98,14.79 61.98,8.36 SW1.4 61.88,6.54 C3.2 66.66,6.54 SW1.3 | JP4.4 72.78,12.89 67.13,12.89 v66.93,12.69
SW2  (via drill 0.35)
  Top 0.305: v77.6,11.23 77.6,8.34 SW2.3
  Bottom 0.305: RN2.6 59.95,18.47 61.6,16.82 61.6,15.88 62.48,15 62.48,9.2 62.99,8.69 68.86,8.69 SW2.4 71.02,6.54 C4.2 75.8,6.54 SW2.3 | JP4.2 77.6,15.17 v77.6,11.23
SW3
  Bottom 0.305: RN2.5 60.58,19.74 62.1,18.22 62.1,16.19 62.99,15.3 62.99,9.41 63.2,9.2 77.5,9.2 SW3.4 80.16,6.54 C8.2 84.95,6.54 SW3.3 91.7,13.29 JP9.9
VCC  (via drill 0.35, 0.5)
  Top 0.406: 69.35,39.43 68.99,39.07 v68.74,39.07 | R5.1 v64.52,36.51
  Top 0.5: Q2.2 59.57,44.76
  Top 2.4: C6.+ 69.35,39.43 66.37,42.4 60.7,42.4 59.57,43.53 59.57,44.76
  Top 2.54: IM10.VCC 83.82,28.56 79.05,33.33 C6.+ | IM4.IN 12.55,43.26 12.55,44.01 14.14,45.6 23.46,45.6
  Bottom 0.406: v64.52,36.51 66.17,36.51 v68.74,39.07
  Bottom 2.54: Q2.2 59.44,45.76 58.08,47.12 47.83,47.12 D3.C
  other vias: 49.28,47.7 48.28,47.7 49.28,46.7 48.28,46.7
  pour Top: 50.5,44.2 50.5,48.2 50.3,48.4 35.18,48.4 34.09,49.49 34.09,56.2 21.1,56.2 19.3,54.4 19.3,45.81 24.61,40.5 36.6,40.5 37.9,41.8 48.1,41.8

### Text on the board
tNames: ON | 32 | 33 | 14 | 12 | OFF | + | GPIO | +5V | GND | I-SERVO | +5V / pinhed | GPIO | A | B | A | B | - | +5V | - | +5V | OUT4 | OUT3 | ULT | OUT2 | OUT1 | SLP | +5V | + | GND | PWM0 | PWM1 | VCC | GND | PWM2 | PWM3 | +3V | RB3202 / SCHOOL-BOARD / V1.0.1 | ON | OFF | EN | +5V | SW0 | SW1 | SW2 | LED0 | LED1 | LED2 | LED3 | SW3 | BAT_REF | - | GPIO_34 | GND | - | +3V | + | POWER | GPIO | 36 | 39 | !34 | !35 | !32 | !33 | !25 | !26 | !27 | !14 | !12 | !21 | IO1 | IO3 | !22 | !23
bNames: + | - | 7-11V | RB3202_SCHOOL-BOARD_V1.0.1